# Altium schematic sheet Functional.SchDoc
size 420 x 297 mm; Address1: Address1; Address2: Address2; Address3: Address3; Address4: Address4; DocumentNumber: АБВГ.123456.001 Э3; SheetNumber: 1; Scale: 1:1; DocumentType: Схема электрическая принципиальная; FirstReferrence: АБВГ.123456.001
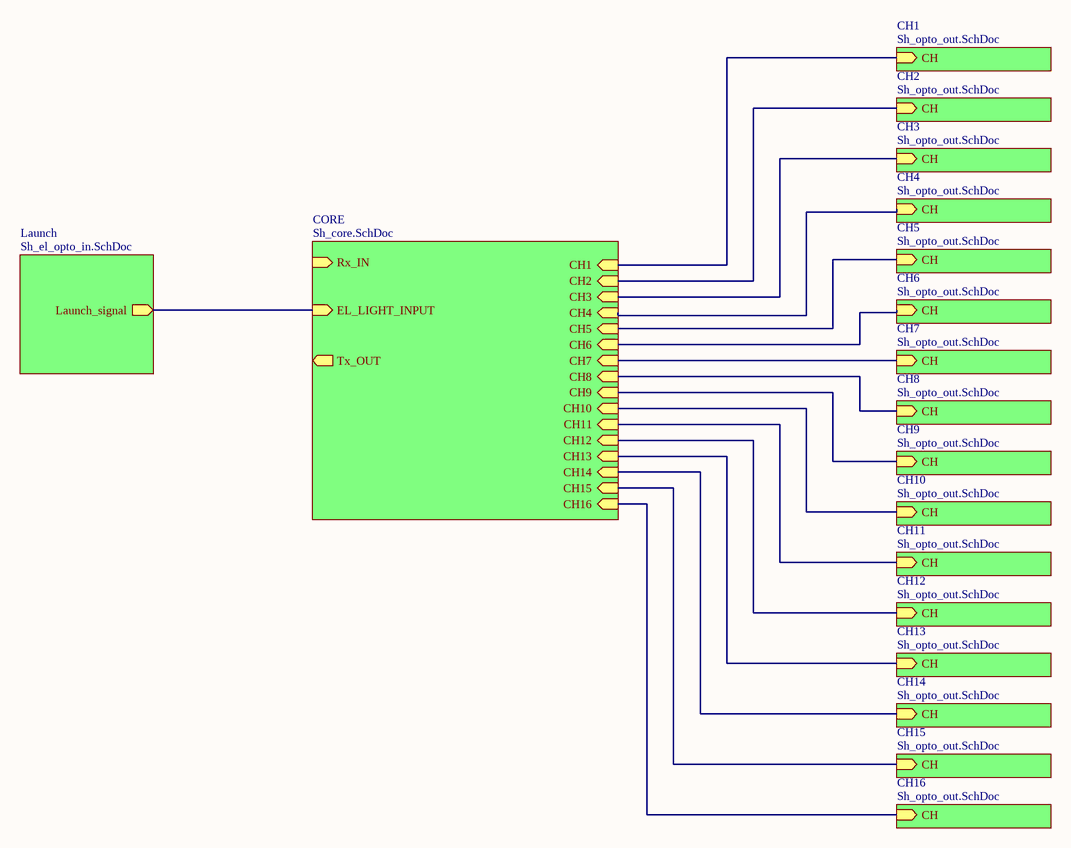
[diagram p0: Functional.SchDoc]

## Sub-sheets
CH1 = Sh_opto_out.SchDoc: CH (in)
CH2 = Sh_opto_out.SchDoc: CH (in)
CH3 = Sh_opto_out.SchDoc: CH (in)
CH4 = Sh_opto_out.SchDoc: CH (in)
CH5 = Sh_opto_out.SchDoc: CH (in)
CH6 = Sh_opto_out.SchDoc: CH (in)
CH7 = Sh_opto_out.SchDoc: CH (in)
CH8 = Sh_opto_out.SchDoc: CH (in)
CH9 = Sh_opto_out.SchDoc: CH (in)
CH10 = Sh_opto_out.SchDoc: CH (in)
CH11 = Sh_opto_out.SchDoc: CH (in)
CH12 = Sh_opto_out.SchDoc: CH (in)
CH13 = Sh_opto_out.SchDoc: CH (in)
CH14 = Sh_opto_out.SchDoc: CH (in)
CH15 = Sh_opto_out.SchDoc: CH (in)
CH16 = Sh_opto_out.SchDoc: CH (in)
CORE = Sh_core.SchDoc: CH1 (in), CH2 (in), CH3 (in), CH4 (in), CH5 (in), CH6 (in), CH7 (in), CH8 (in), CH9 (in), CH10 (in), CH11 (in), CH12 (in), CH13 (in), CH14 (in), CH15 (in), CH16 (in), Rx_IN (in), Tx_OUT (out), EL_LIGHT_INPUT (in)
Launch = Sh_el_opto_in.SchDoc: Launch_signal (out)

## Nets
(unnamed): sheet CORE/CH1, sheet CH1/CH
(unnamed): sheet CORE/CH2, sheet CH2/CH
(unnamed): sheet CORE/CH3, sheet CH3/CH
(unnamed): sheet CORE/CH4, sheet CH4/CH
(unnamed): sheet CORE/CH5, sheet CH5/CH
(unnamed): sheet CORE/CH6, sheet CH6/CH
(unnamed): sheet CORE/CH7, sheet CH7/CH
(unnamed): sheet CORE/CH8, sheet CH8/CH
(unnamed): sheet CORE/CH9, sheet CH9/CH
(unnamed): sheet CORE/CH10, sheet CH10/CH
(unnamed): sheet CORE/CH11, sheet CH11/CH
(unnamed): sheet CORE/CH12, sheet CH12/CH
(unnamed): sheet CORE/CH13, sheet CH13/CH
(unnamed): sheet CORE/CH14, sheet CH14/CH
(unnamed): sheet CORE/CH15, sheet CH15/CH
(unnamed): sheet CORE/CH16, sheet CH16/CH
(unnamed): sheet CORE/EL_LIGHT_INPUT, sheet Launch/Launch_signal

## Notes on the sheet
- Перв. примен.
- Справ. №
- Подп. и дата
- Инв. № дубл.
- Взам. инв. №
- Разраб.
- Изм.
- Лист
- № докум.
- Подп.
- Дата
- Лит.
- Масса
- Масштаб
- Пров.
- Т.контр.
- Листов
- Инв. № подл.
- Утв.
- Н.контр.
- 2.106-A3
- Копировал
- Формат А3